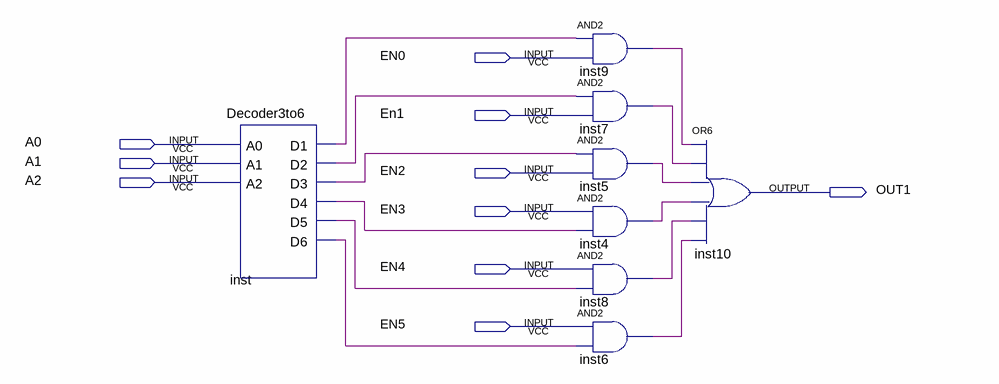
[diagram p0: schematic sheet]
// Quartus schematic MUX6-1.bdf as structural Verilog: 8 symbols, 10 pins
module \MUX6-1  (
  input  EN0,
  input  En1,
  input  A0,
  input  A1,
  input  EN2,
  input  A2,
  input  EN3,
  input  EN4,
  input  EN5,
  output OUT1
);

  wire inst4_out, inst5_out, inst6_out, inst7_out, inst8_out, inst9_out, inst_d1, inst_d2, inst_d3, inst_d4,
       inst_d5, inst_d6;

  Decoder3to6 inst (
    .A0(A0), .A1(A1), .A2(A2), .D1(inst_d1), .D2(inst_d2), .D3(inst_d3), .D4(inst_d4), .D5(inst_d5),
    .D6(inst_d6));
  and inst9 (inst9_out, inst_d1, EN0);
  and inst7 (inst7_out, inst_d2, En1);
  and inst5 (inst5_out, inst_d3, EN2);
  and inst4 (inst4_out, EN3, inst_d4);
  and inst8 (inst8_out, EN4, inst_d5);
  and inst6 (inst6_out, EN5, inst_d6);
  or inst10 (OUT1, inst9_out, inst7_out, inst5_out, inst4_out, inst8_out, inst6_out);
endmodule
